# EAGLE design BreakoutBusinessCard (EAGLE 6.1)
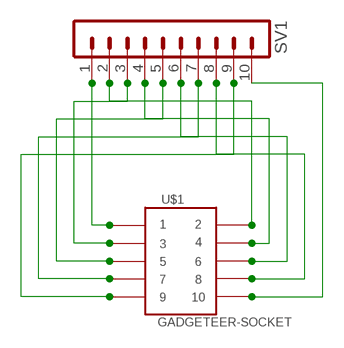
[diagram p0: schematic, sheet 1]

## Parts
SV1  MA10-1  [MA10-1]
U$1  GADGETEER-SOCKET  [2X5_1.27MM]

## Nets
N$1: SV1.1 U$1.1
N$2: SV1.3 U$1.3
N$3: SV1.5 U$1.5
N$4: SV1.7 U$1.7
N$5: SV1.9 U$1.9
N$6: SV1.2 U$1.2
N$7: SV1.4 U$1.4
N$8: SV1.6 U$1.6
N$9: SV1.8 U$1.8
N$10: SV1.10 U$1.10

## Library data of the parts
SV1 = con-lstb:MA10-1: PIN HEADER; OC_FARNELL: unknown; OC_NEWARK: unknown
U$1 = SoftDust:GADGETEER-SOCKET

## Board
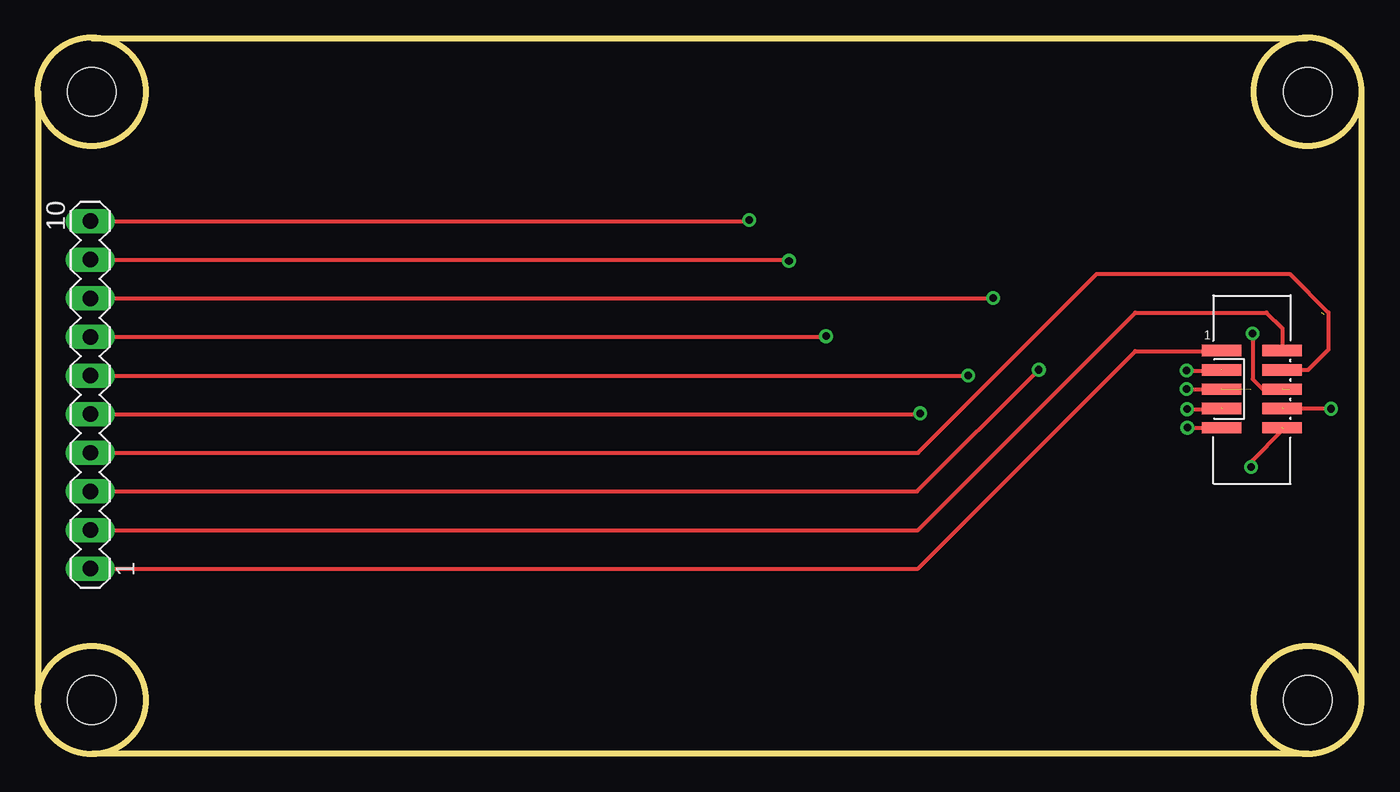
[diagram p1: board, top side]
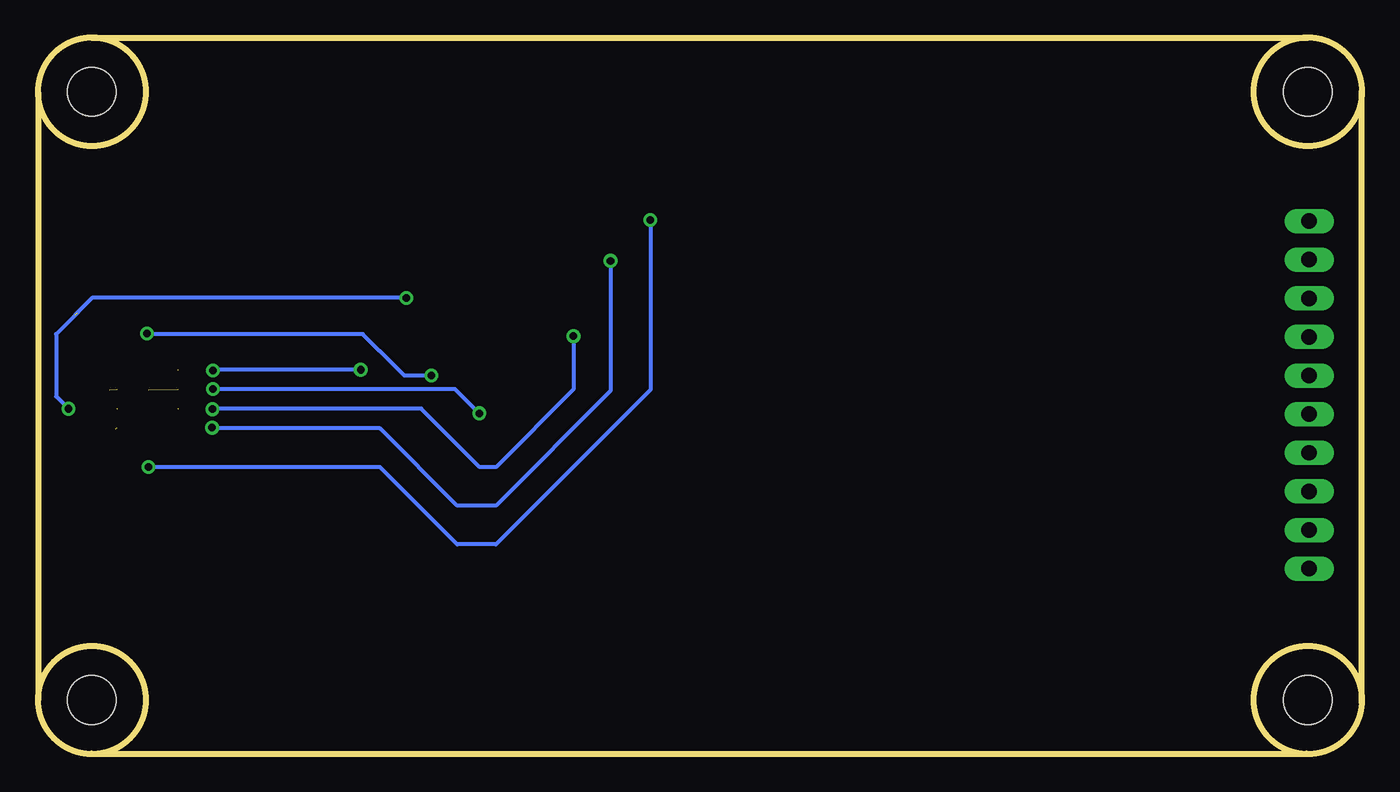
[diagram p2: board, bottom side, seen from below]

Size 87.08 x 47.07 mm. Coordinates in mm from the lower left corner, seen from the top.
Outline: 0.01,43.57 0.01,3.39
Outline: 3.54,47.07 83.52,47.07
Outline: 87.08,43.49 87.08,3.51
Outline: 83.55,0.01 3.62,0.01
Outline: circle at 3.54,43.54 radius 3.54
Outline: circle at 3.54,3.54 radius 3.54
Outline: circle at 83.54,43.54 radius 3.54
Outline: circle at 83.54,3.54 radius 3.54
Copper layers (1*16): Top 0.035mm / dielectric 1.5mm / Bottom 0.035mm
Design rules: minimum track width 6mil, minimum drill 12mil, track to track 6mil, track to pad 6mil, pad to pad 6mil, via to via 6mil, smd to smd 0mil, copper to edge 10mil, drill to drill 10mil, minimum pad ring 12mil, minimum via ring 8mil, stop-mask expansion 2mil, vias tented up to drill 25mil, thermal gap 10mil
Holes 3.2 mm at 3.54,43.54 83.54,43.54 83.54,3.54 3.54,3.54

### Footprints (pad centres in the part's own frame; a part is rotated, then mirrored left to right if it is on the bottom)
MA10-1 = drill 1.016 long: 1 -11.43,0; 2 -8.89,0; 3 -6.35,0; 4 -3.81,0; 5 -1.27,0; 6 1.27,0; 7 3.81,0; 8 6.35,0; 9 8.89,0; 10 11.43,0
2X5_1.27MM = smd 2.6 x 0.74: 1 -2,2.58; 2 2,2.58; 3 -2,1.31; 4 2,1.31; 5 -2,0.04; 6 2,0.04; 7 -2,-1.23; 8 2,-1.23; 9 -2,-2.5; 10 2,-2.5

### Placement (x,y rotation side)
SV1  3.44,23.61 90 top
U$1  79.87,23.94 0 top

### Tracks (layer width: path | path; a pad name or v marks a point on that pad's centre or on a via)
N$1
  Top 0.254: SV1.1 57.9,12.18 72.2,26.48 77.24,26.48 U$1.1
N$2  (via drill 0.5)  (1 unrouted)
  Top 0.254: SV1.3 57.84,17.26 v65.85,25.26 | v75.57,25.21 77.83,25.21 77.89,25.26
  Bottom 0.254: v65.85,25.26 75.52,25.26 v75.57,25.21
N$3  (via drill 0.5)  (1 unrouted)
  Top 0.254: SV1.5 58,22.34 v58.05,22.39 | v75.57,23.99 v75.58,23.98 U$1.5
  Bottom 0.254: v58.05,22.39 59.65,23.99 v75.57,23.99
N$4  (via drill 0.5)  (1 unrouted)
  Top 0.254: SV1.7 51.8,27.42 v51.85,27.47 | v75.6,22.67 77.83,22.67 77.89,22.72
  Bottom 0.254: v51.85,27.47 51.85,23.96 56.96,18.86 58.02,18.86 61.86,22.69 75.57,22.69 v75.6,22.67
N$5  (via drill 0.5)
  Top 0.254: SV1.9 49.34,32.5 v49.41,32.42 | v75.62,21.45 77.86,21.45 U$1.9
  Bottom 0.254: v49.41,32.42 49.41,23.86 56.96,16.32 59.5,16.32 64.58,21.4 75.57,21.4 v75.62,21.45
N$6
  Top 0.254: SV1.2 57.9,14.72 72.2,29.02 80.83,29.02 81.87,27.97 U$1.2
N$7
  Top 0.254: SV1.4 57.9,19.8 69.66,31.56 82.36,31.56 84.9,29.02 84.9,26.58 83.55,25.23 81.88,25.23 U$1.4
N$8  (via drill 0.5)  (1 unrouted)
  Top 0.254: SV1.6 v61.2,24.88 | v79.92,27.64 79.92,24.65 80.65,23.91 82.33,23.91 82.36,23.94
  Bottom 0.254: v61.2,24.88 62.98,24.88 64.58,26.48 64.6,26.48 65.72,27.59 79.87,27.59 v79.92,27.64
N$9  (via drill 0.5)  (2 unrouted)
  Top 0.254: v85.07,22.69 81.92,22.69 81.9,22.72 | SV1.8 62.82,29.96 v62.85,29.98
  Bottom 0.254: 84.46,29.02 85.89,27.59 85.89,23.5 v85.07,22.69 | v62.85,29.98 83.52,29.98 84.62,28.89
N$10  (via drill 0.5)  (1 unrouted)
  Top 0.254: SV1.10 46.72,35.04 v46.8,35.11 | v79.82,18.86 79.82,19.21 81.97,21.37
  Bottom 0.254: v46.8,35.11 46.8,23.94 56.96,13.78 59.5,13.78 64.58,18.86 v79.82,18.86